# EAGLE design imu_v2_side (EAGLE 6.4)
REV: 2.0
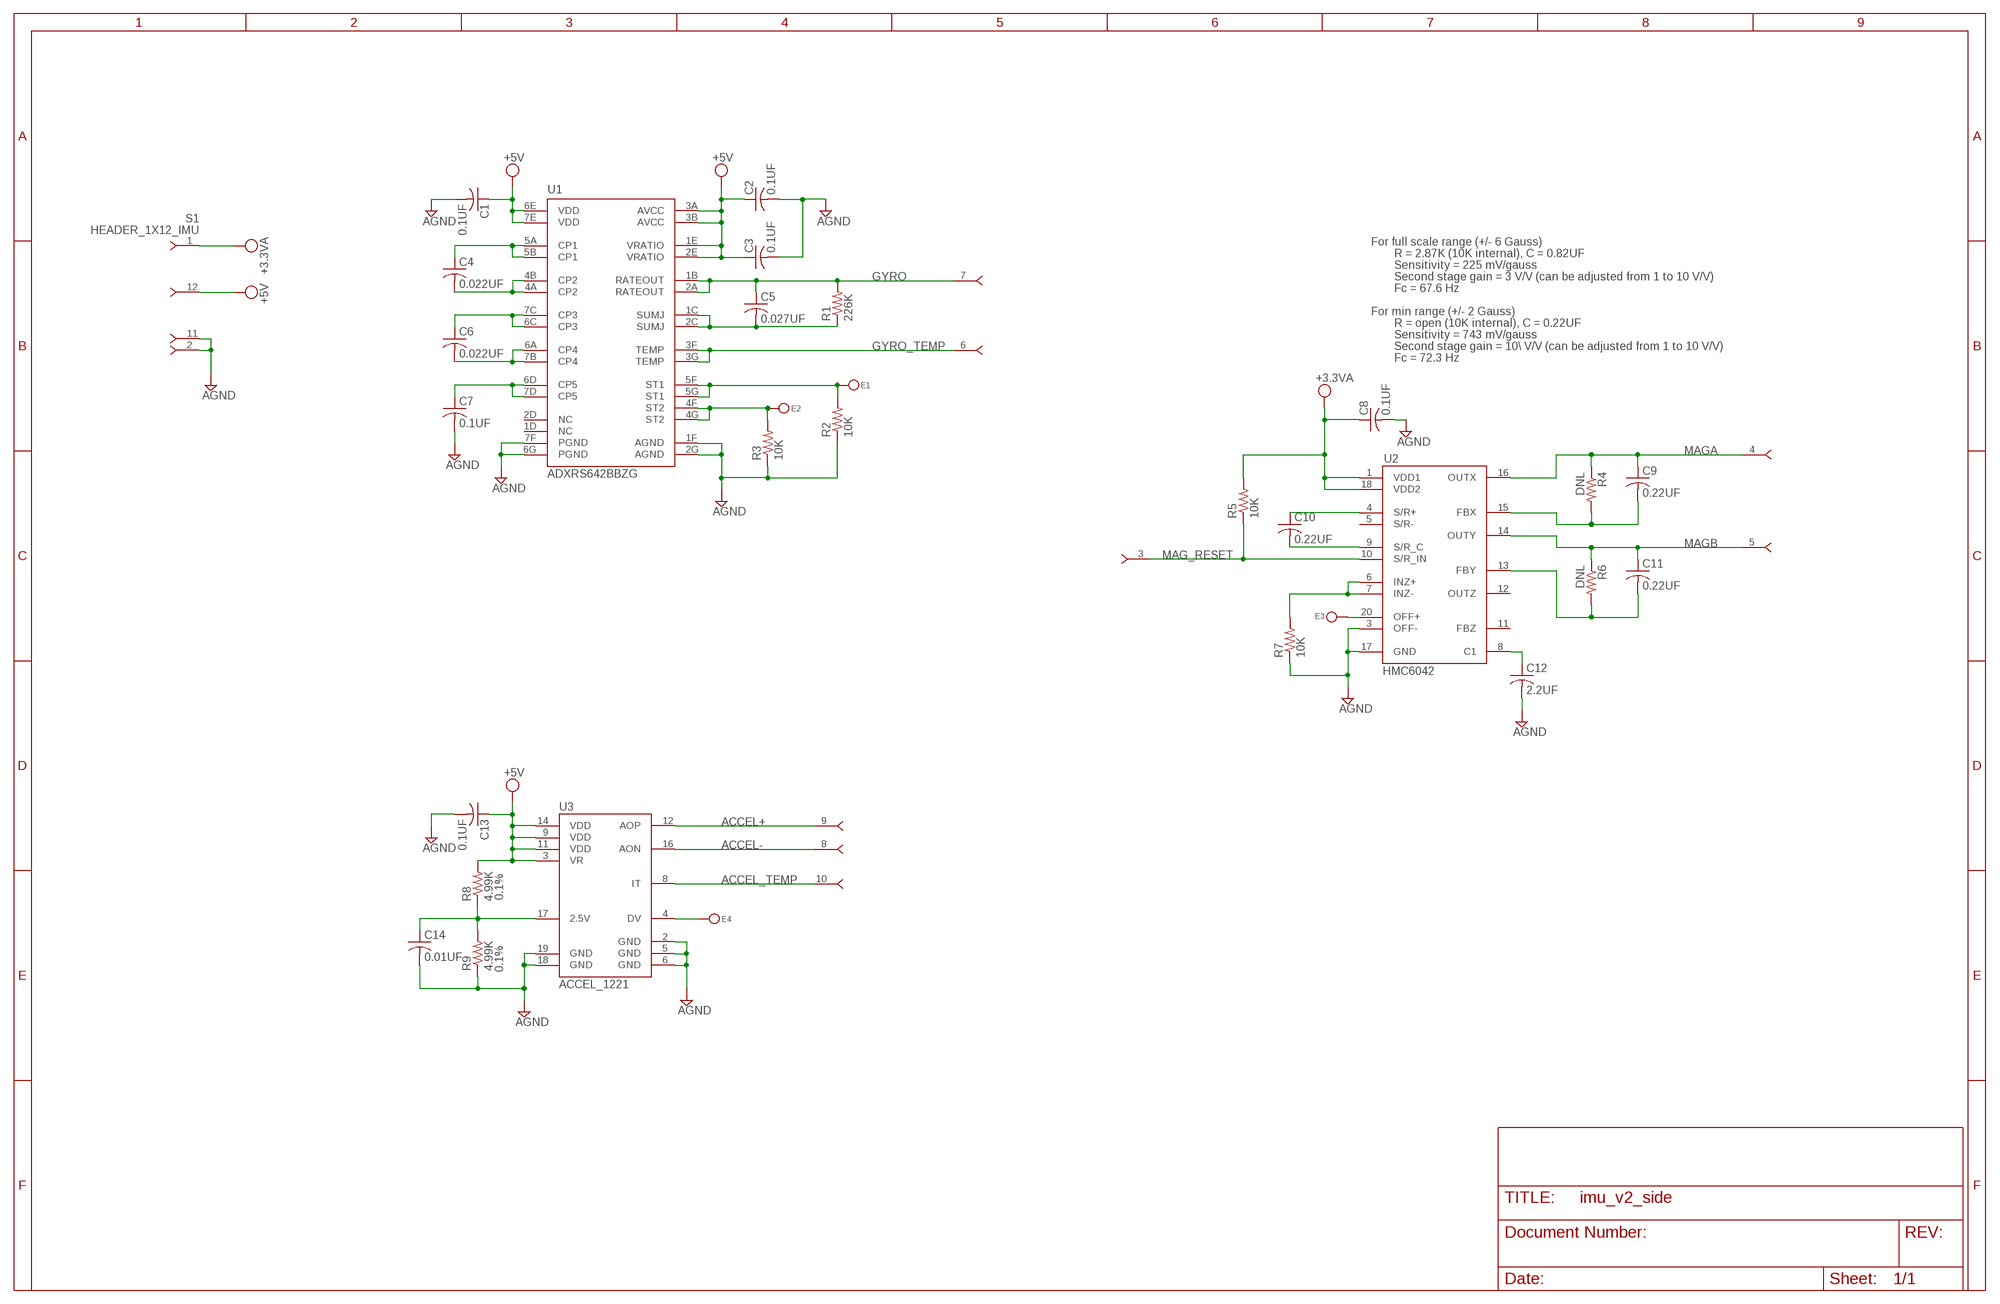
[diagram p0: schematic, sheet 1]

## Parts
C1  0.1UF  C-USC0603K  [C0603K]
C2  0.1UF  C-USC0603K  [C0603K]
C3  0.1UF  C-USC0603K  [C0603K]
C4  0.022UF  C-USC0603K  [C0603K]
C5  0.027UF  C-USC0603K  [C0603K]
C6  0.022UF  C-USC0603K  [C0603K]
C7  0.1UF  C-USC0603K  [C0603K]
C8  0.1UF  C-USC0603K  [C0603K]
C9  0.22UF  C-USC0603K  [C0603K]
C10  0.22UF  C-USC0603K  [C0603K]
C11  0.22UF  C-USC0603K  [C0603K]
C12  2.2UF  C-USC0603K  [C0603K]
C13  0.1UF  C-USC0603K  [C0603K]
C14  0.01UF  C-USC0603K  [C0603K]
E1  TP30  [TP30]
E2  TP30  [TP30]
E3  TP30  [TP30]
E4  TP30  [TP30]
R1  226K  R-US_R0603  [R0603]
R2  10K  R-US_R0603  [R0603]
R3  10K  R-US_R0603  [R0603]
R4  DNL  R-US_R0603  [R0603]
R5  10K  R-US_R0603  [R0603]
R6  DNL  R-US_R0603  [R0603]
R7  10K  R-US_R0603  [R0603]
R8  4.99K  R-US_R0603  [R0603]
R9  4.99K  R-US_R0603  [R0603]
S1  HEADER_1X12_IMU  [HEADER_1X12_2MM_TH]
U1  ADXRS642BBZG  [ADXRS_CBGA32]
U2  HMC6042  [HMC6042_LPCC]
U3  ACCEL_1221  [1221_LCC]

## Nets
+3.3VA: C8.1 R5.2 S1.1 U2.1(VDD1) U2.18(VDD2)
+5V: C1.1 C2.1 C3.1 C13.1 R8.2 S1.12 U1.1E(VRATIO) U1.2E(VRATIO) U1.3A(AVCC) U1.3B(AVCC) U1.6E(VDD) U1.7E(VDD) U3.3(VR) U3.9(VDD) U3.11(VDD) U3.14(VDD)
ACCEL+: S1.9 U3.12(AOP)
ACCEL-: S1.8 U3.16(AON)
ACCEL_TEMP: S1.10 U3.8(IT)
AGND: C1.2 C2.2 C3.2 C7.2 C8.2 C12.2 C13.2 C14.2 R2.1 R3.1 R7.1 R9.1 S1.2 S1.11 U1.1F(AGND) U1.2G(AGND) U1.6G(PGND) U1.7F(PGND) U2.3(OFF-) U2.17(GND) U3.2(GND) U3.5(GND) U3.6(GND) U3.18(GND) U3.19(GND)
GYRO: C5.1 R1.2 S1.7 U1.1B(RATEOUT) U1.2A(RATEOUT)
GYRO_ST1: E1.1 R2.2 U1.5F(ST1) U1.5G(ST1)
GYRO_ST2: E2.1 R3.2 U1.4F(ST2) U1.4G(ST2)
GYRO_TEMP: S1.6 U1.3F(TEMP) U1.3G(TEMP)
MAG_RESET: R5.1 S1.3 U2.10(S/R_IN)
MAGA: C9.1 R4.1 S1.4 U2.16(OUTX)
MAGB: C11.1 R6.1 S1.5 U2.14(OUTY)
N$1: C4.1 U1.5A(CP1) U1.5B(CP1)
N$2: C4.2 U1.4A(CP2) U1.4B(CP2)
N$3: C6.1 U1.6C(CP3) U1.7C(CP3)
N$4: C6.2 U1.6A(CP4) U1.7B(CP4)
N$5: C7.1 U1.6D(CP5) U1.7D(CP5)
N$6: C14.1 R8.1 R9.2 U3.17(2.5V)
N$7: C5.2 R1.1 U1.1C(SUMJ) U1.2C(SUMJ)
N$8: E4.1 U3.4(DV)
N$14: E3.1 U2.20(OFF+)
N$15: R7.2 U2.6(INZ+) U2.7(INZ-)
N$16: C10.1 U2.4(S/R+)
N$17: C10.2 U2.9(S/R_C)
N$18: C12.1 U2.8(C1)
N$20: C9.2 R4.2 U2.15(FBX)
N$22: C11.2 R6.2 U2.13(FBY)
Unconnected: U1.1D(NC) U1.2D(NC) U2.5(S/R-) U2.11(FBZ) U2.12(OUTZ)

## Notes on the sheet
- For full scale range (+/- 6 Gauss)
- R = 2.87K (10K internal), C = 0.82UF
- Sensitivity = 225 mV/gauss
- Second stage gain = 3 V/V (can be adjusted from 1 to 10 V/V)
- Fc = 67.6 Hz
- For min range (+/- 2 Gauss)
- R = open (10K internal), C = 0.22UF
- Sensitivity = 743 mV/gauss
- Second stage gain = 10\ V/V (can be adjusted from 1 to 10 V/V)
- Fc = 72.3 Hz

## Library data of the parts
C1-C14 = rcl:C-US: CAPACITOR, American symbol
E1-E4 = connector:TP30
R1-R7 = rcl:R-US_: RESISTOR, American symbol
R8 R9 = rcl:R-US_: RESISTOR, American symbol; TOL: 0.1%
S1 = connector:HEADER_1X12_IMU
U1 = sensor:ADXRS*: Analog Devices MEMS GRYO; VENDOR: Digikey; VENDOR_PN: ADXRS642BBGZ-ND
U2 = sensor:HMC6042; VENDOR: Digikey; VENDOR_PN: 342-1055-1-ND
U3 = sensor:ACCEL_1221: Precision MEMS accelerometer.; VENDOR: Silicon Designs; VENDOR_PN: 1221L-050

## Board
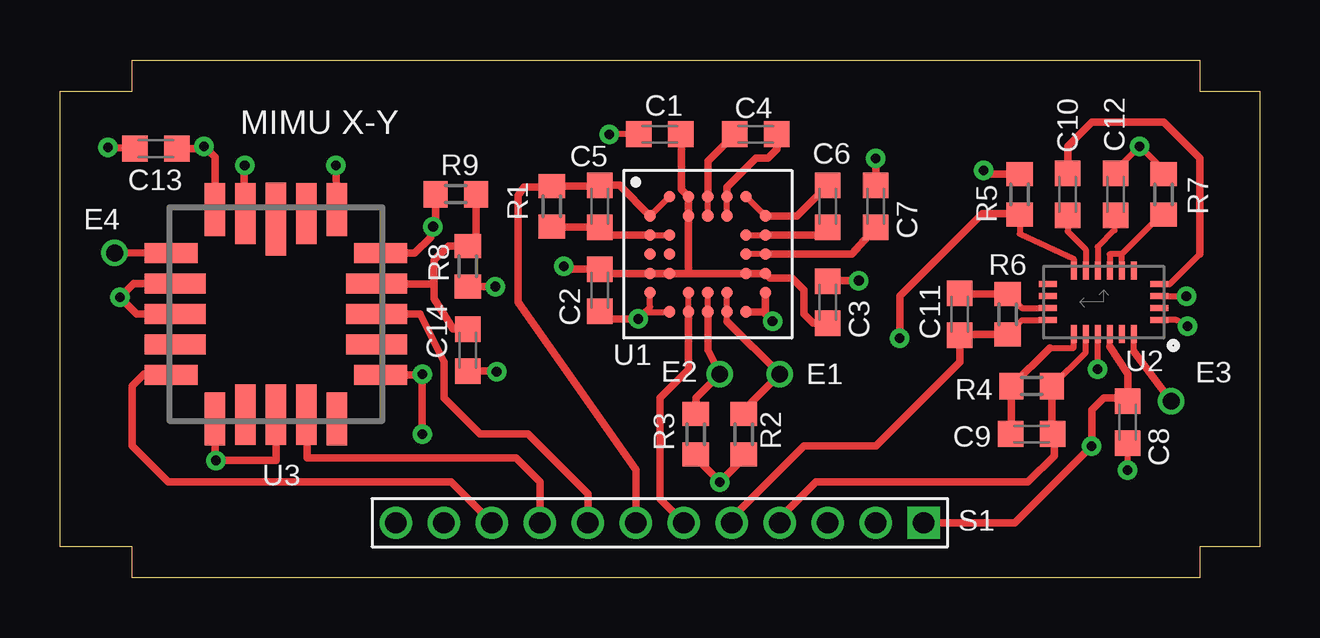
[diagram p1: board, top side]
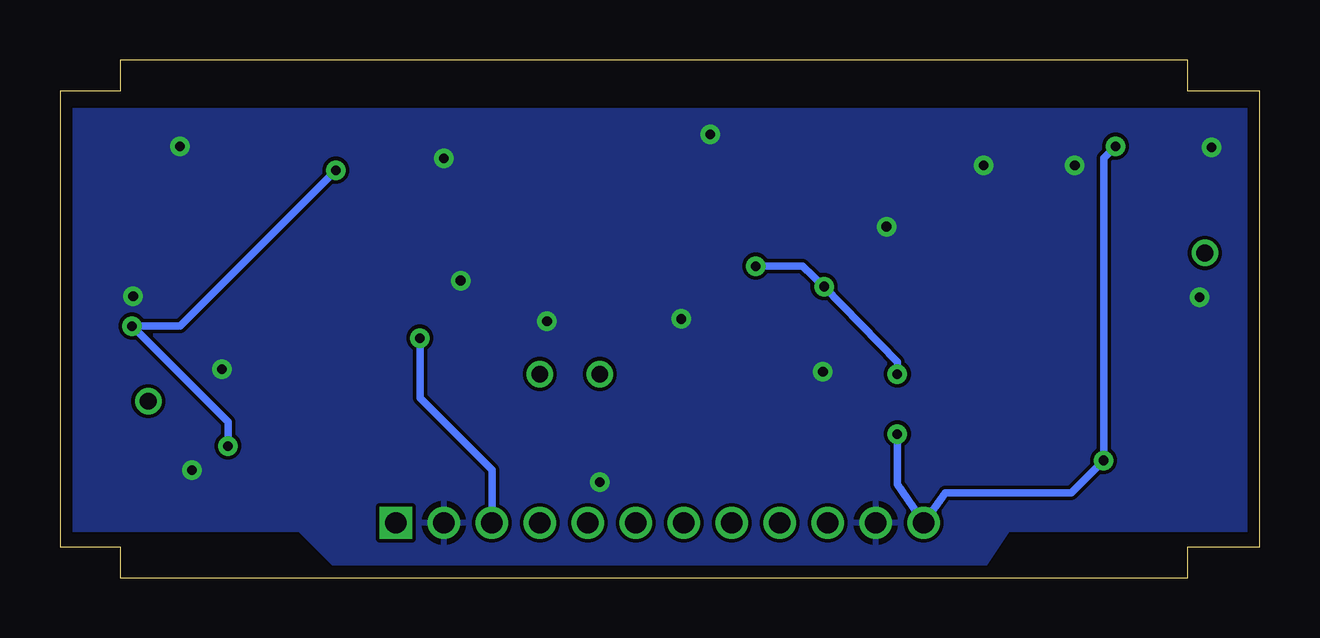
[diagram p2: board, bottom side, seen from below]

Size 50 x 21.6 mm. Coordinates in mm from the lower left corner, seen from the top.
Outline: 0,1.3 0,20.3 3,20.3 3,21.6 47.5,21.6 47.5,20.3 50,20.3 50,1.3 47.5,1.3 47.5,0 3,0 3,1.3 0,1.3
Copper layers (1*16): Top 0.0178mm / dielectric 59mil / Bottom 0.0178mm
Design rules "SSC-EAGLE-2Lyr_v1.0.0.3 *": minimum track width 6mil, minimum drill 14mil, track to track 6mil, track to pad 6mil, pad to pad 6mil, via to via 6mil, smd to smd 6mil, copper to edge 20mil, drill to drill 16mil, minimum pad ring 8mil, minimum via ring 8mil, stop-mask expansion 3mil, vias tented up to drill 0mil, thermal gap 10mil

### Footprints (pad centres in the part's own frame; a part is rotated, then mirrored left to right if it is on the bottom)
C0603K = smd 1.05 x 1.08: 1 -0.875,0; 2 0.875,0
TP30 = drill 0.7: 1 0,0
R0603 = smd 1 x 1.1: 1 -0.85,0; 2 0.85,0
HEADER_1X12_2MM_TH = drill 0.889 square: 1 0,0 | drill 0.889: 2 2,0; 3 4,0; 4 6,0; 5 8,0; 6 10,0; 7 12,0; 8 14,0; 9 16,0; 10 18,0; 11 20,0; 12 22,0
ADXRS_CBGA32 = smd 0.47 x 0.47: 1B -2.4,1.6; 1C -2.4,0.8; 1D -2.4,0; 1E -2.4,-0.8; 1F -2.4,-1.6; 2A -1.6,2.4; 2C -1.6,0.8; 2D -1.6,0; 2E -1.6,-0.8; 2G -1.6,-2.4; 3A -0.8,2.4; 3B -0.8,1.6; 3F -0.8,-1.6; 3G -0.8,-2.4; 4A 0,2.4; 4B 0,1.6; 4F 0,-1.6; 4G 0,-2.4; 5A 0.8,2.4; 5B 0.8,1.6; 5F 0.8,-1.6; 5G 0.8,-2.4; 6A 1.6,2.4; 6C 1.6,0.8; 6D 1.6,0; 6E 1.6,-0.8; 6G 1.6,-2.4; 7B 2.4,1.6; 7C 2.4,0.8; 7D 2.4,0; 7E 2.4,-0.8; 7F 2.4,-1.6
HMC6042_LPCC = smd 0.75 x 0.25: 1 -2.325,0.75; 2 -2.325,0.25; 3 -2.325,-0.25; 4 -2.325,-0.75; 11 2.325,-0.75; 12 2.325,-0.25; 13 2.325,0.25; 14 2.325,0.75 | smd 0.25 x 0.75: 5 -1.25,-1.325; 6 -0.75,-1.325; 7 -0.25,-1.325; 8 0.25,-1.325; 9 0.75,-1.325; 10 1.25,-1.325; 15 1.25,1.325; 16 0.75,1.325; 17 0.25,1.325; 18 -0.25,1.325; 19 -0.75,1.325; 20 -1.25,1.325
1221_LCC = smd 0.838 x 3.048: 1 0,3.962 | smd 0.838 x 2.54: 2 -1.27,4.191; 10 -1.27,-4.191; 11 0,-4.191; 12 1.27,-4.191; 20 1.27,4.191 | smd 0.838 x 2.21: 3 -2.54,4.369; 9 -2.54,-4.369; 13 2.54,-4.369; 19 2.54,4.369 | smd 2.21 x 0.838: 4 -4.369,2.54; 8 -4.369,-2.54; 14 4.369,-2.54; 18 4.369,2.54 | smd 2.54 x 0.838: 5 -4.191,1.27; 6 -4.191,0; 7 -4.191,-1.27; 15 4.191,-1.27; 16 4.191,0; 17 4.191,1.27

### Placement (x,y rotation side)
C1  25,18.5 180 top
C2  22.5,12 270 top
C3  32,11.5 90 top
C4  29,18.5 180 top
C5  22.5,15.5 270 top
C6  32,15.5 90 top
C7  34,15.5 90 top
C8  44.5,6.5 270 top
C9  40.5,6 180 top
C10  42,16 270 top
C11  37.5,11 90 top
C12  44,16 90 top
C13  4,17.9 180 top
C14  17,9.5 270 top
E1  30,8.5 0 top
E2  27.5,8.5 0 top
E3  46.32,7.37 0 top
E4  2.28,13.55 0 top
R1  20.5,15.5 90 top
R2  28.5,6 90 top
R3  26.5,6 90 top
R4  40.5,8 180 top
R5  40,16 90 top
R6  39.5,11 90 top
R7  46,16 270 top
R8  17,13 270 top
R9  16.5,16 0 top
S1  36,2.3 180 top
U1  27,13.5 0 top
U2  43.5,11.5 180 top
U3  9,11 0 top

### Tracks (layer width: path | path; a pad name or v marks a point on that pad's centre or on a via)
+3.3VA  (via drill 0.41)
  Top 0.254: 43.75,9.65 U2.18 | 44.38,7.5 C8.1 | U2.1 46.55,10.75 v47,10.5
  Top 0.305: 43.75,9.65 44.5,8.5 C8.1 | S1.1 39.8,2.3 v43,5.5 43,7 43.5,7.5 44.38,7.5 | R5.2 38.65,16.85 v38.5,17
  Bottom 0.305: v43,5.5 43,6.5 v47,10.5 45,10.5 v38.5,17
+5V  (via drill 0.41)
  Top 0.254: 25.9,18.48 C1.1 | C2.1 22.68,12.7 | v6.5,4.9 6.46,5.04 | v15.1,8.5 14.96,8.46 | v6,18 5.9,17.9
  Top 0.305: 22.68,12.7 U1.1E U1.2E 26.2,12.7 | C3.1 31.38,10.62 31,11 31,12 30.5,12.5 29.6,12.5 U1.7E U1.6E 26.2,12.7 | 25.9,18.48 25.9,16.2 U1.3A U1.3B 26.2,12.7 | 6.46,5.04 U3.9 | U3.11 9,4.9 v6.5,4.9 | 14.96,8.46 U3.14 | 5.9,17.9 C13.1 | U3.3 6.46,17.54 v6,18 | C2.1 21.12,12.88 v21,13 | v18.15,12.15 R8.2 | v15.1,6 v15.1,8.5
  Bottom 0.305: v6,18 6.5,17.5 v6.5,4.9 7.85,3.55 13.1,3.55 S1.12 15.1,3.9 v15.1,6 | v15.1,8.5 15.1,9 v18.15,12.15 19.05,13 v21,13
ACCEL+
  Top 0.254: 10.3,6.63 U3.12
  Top 0.305: S1.9 20,4 19,5 10.3,5 10.3,6.63
ACCEL-
  Top 0.305: U3.16 15,11 16,9 16,7.5 17.5,6 19.5,6 22,3.5 S1.8
ACCEL_TEMP
  Top 0.254: 4.59,8.5 U3.8
  Top 0.305: S1.10 16.3,4 4.5,4 3,5.5 3,8 3.5,8.5 4.59,8.5
AGND  (via drill 0.41)
  Top 0.254: U3.6 3.67,11.03 | U1.1F 24.6,11.3 v24.1,10.8 | 24.4,11.1 U1.2G | 29.3,11.1 v29.7,10.7 | U3.2 7.63,14.87 | U3.19 11.54,15.84 | C1.2 v22.9,18.5 | C3.2 32.02,12.4 | C2.2 22.82,10.8 | 2.65,17.93 C13.2 | 18.18,8.62 v18.2,8.6 | v43.25,8.7 U2.17 | U2.3 v46.95,11.75 | C12.2 44,17 v45,18 46,17 R7.1 | v44.5,4.5 C8.2 | 26.5,5 R3.1 | 28.5,5 R2.1
  Top 0.305: 24.4,11.1 v24.1,10.8 22.82,10.8 | U1.6G 29.3,11.1 | U1.7F 29.4,11 v29.7,10.7 | U3.6 3.2,11 v2.5,11.7 3.07,12.27 U3.5 | 7.63,14.87 v7.7,17.2 | 11.54,15.84 v11.5,17.2 | C7.2 v34,17.5 | 32.02,12.4 v33.3,12.4 | v2,17.95 2.65,17.93 | U3.18 14.79,13.54 15.45,14.2 15.5,14.6 v15.55,14.65 15.65,14.75 R9.1 | C14.2 18.18,8.62 | 26.5,5 v27.5,4 28.5,5
  pour Bottom: 0,2 10.5,2 11.5,0.5 38.5,0.5 40,2 50,2 50,19.5 0,19.5
GYRO
  Top 0.254: 22.48,16.35 C5.1 | U1.1B U1.2A | 20.45,16.3 R1.2
  Top 0.305: R1.2 22.48,16.35 | U1.1B 23.32,16.38 C5.1 | S1.7 24,4.5 19.1,11.5 19.1,15.95 19.35,16.3 20.45,16.3
GYRO_ST1
  Top 0.254: U1.5F U1.5G 27.8,10.7 | R2.2 28.5,7
  Top 0.305: 27.8,10.7 E1.1 28.5,7
GYRO_ST2
  Top 0.254: U1.4G U1.4F
  Top 0.305: U1.4G 27,9.5 E2.1 26.5,7.5 R3.2
GYRO_TEMP
  Top 0.254: U1.3G U1.3F
  Top 0.305: U1.3G 26.2,8.7 25,7.5 25,3.3 S1.6
MAG_RESET  (via drill 0.41)
  Top 0.254: U2.10 42.25,13.3 40,14.35 R5.1 39.95,15.2
  Top 0.305: v35,10 35,11.75 38.45,15.2 39.95,15.2
  Bottom 0.305: S1.3 32,4.5 35,7.5 v35,10
MAGA
  Top 0.254: U2.16 42.75,9.4 R4.1 | 41.35,6.03 C9.1 41.45,5.92
  Top 0.305: 41.35,6.03 R4.1 | S1.4 30,2.5 31.5,4 40.35,4 41.45,5.1 41.45,5.92
MAGB
  Top 0.254: U2.14 40.1,10.75 R6.1 | 37.52,10.15 C11.1 37.38,10 | S1.5 28,2.5
  Top 0.305: 37.52,10.15 R6.1 | 28,2.5 31,5.5 34,5.5 37.5,9 C11.1
N$1
  Top 0.254: U1.5B U1.5A
  Top 0.305: U1.5A 27.8,16.3 29,17.5 29.5,17.5 29.88,17.88 C4.1
N$2
  Top 0.254: 27,15 U1.4B U1.4A
  Top 0.305: U1.4A 27,17.38 C4.2
N$3
  Top 0.254: U1.6C U1.7C | 31.68,14.3 C6.1
  Top 0.305: U1.7C 31.68,14.3
N$4
  Top 0.254: U1.7B U1.6A
  Top 0.305: U1.7B 30.73,15.1 C6.2
N$5
  Top 0.254: U1.7D U1.6D
  Top 0.305: U1.7D 33,13.5 C7.1
N$6
  Top 0.254: R8.1 17.35,14.2 | U3.17 13.21,12.25
  Top 0.305: 17.35,14.2 R9.2 | C14.1 16.38,10.38 15.6,11.65 15.6,12.25 | R8.1 16.2,13.85 15.6,13.25 15.6,12.25 | 13.21,12.25 15.6,12.25
N$7
  Top 0.254: U1.1C U1.2C | C5.2 22.82,14.3 | R1.1 20.52,14.62
  Top 0.305: 22.82,14.3 U1.1C | 20.52,14.62 C5.2
N$8
  Top 0.254: 4.9,13.57 U3.4
  Top 0.305: E4.1 4.9,13.57
N$14
  Top 0.254: 44.75,9.44 U2.20
  Top 0.305: E3.1 44.75,9.44
N$15
  Top 0.254: R7.2 45.9,15.15 44.25,13.5 | U2.6 44.25,13.5 | U2.7 43.75,13.5 44.25,13.5
N$16
  Top 0.254: U2.4 46.25,12.25 47.5,13.5
  Top 0.305: 47.5,13.5 47.5,17.5 46,19 43,19 42,18 C10.1
N$17
  Top 0.254: C10.2 42,14.45 42.75,13.7 U2.9
N$18
  Top 0.254: C12.1 43.95,14.5 43.25,13.8 U2.8
N$20
  Top 0.254: U2.15 42.25,9.6 41.25,9.6 | C9.2 39.65,6.03
  Top 0.305: 41.25,9.6 R4.2 39.65,6.03
N$22
  Top 0.254: U2.13 40.1,11.25 R6.2 | C11.2 37.52,11.85
  Top 0.305: 37.52,11.85 R6.2

### Text on the board
Top: Layer 1
Bottom: Layer 2
tPlace: MIMU X-Y